# EAGLE design rainforest (EAGLE 6.5.0)
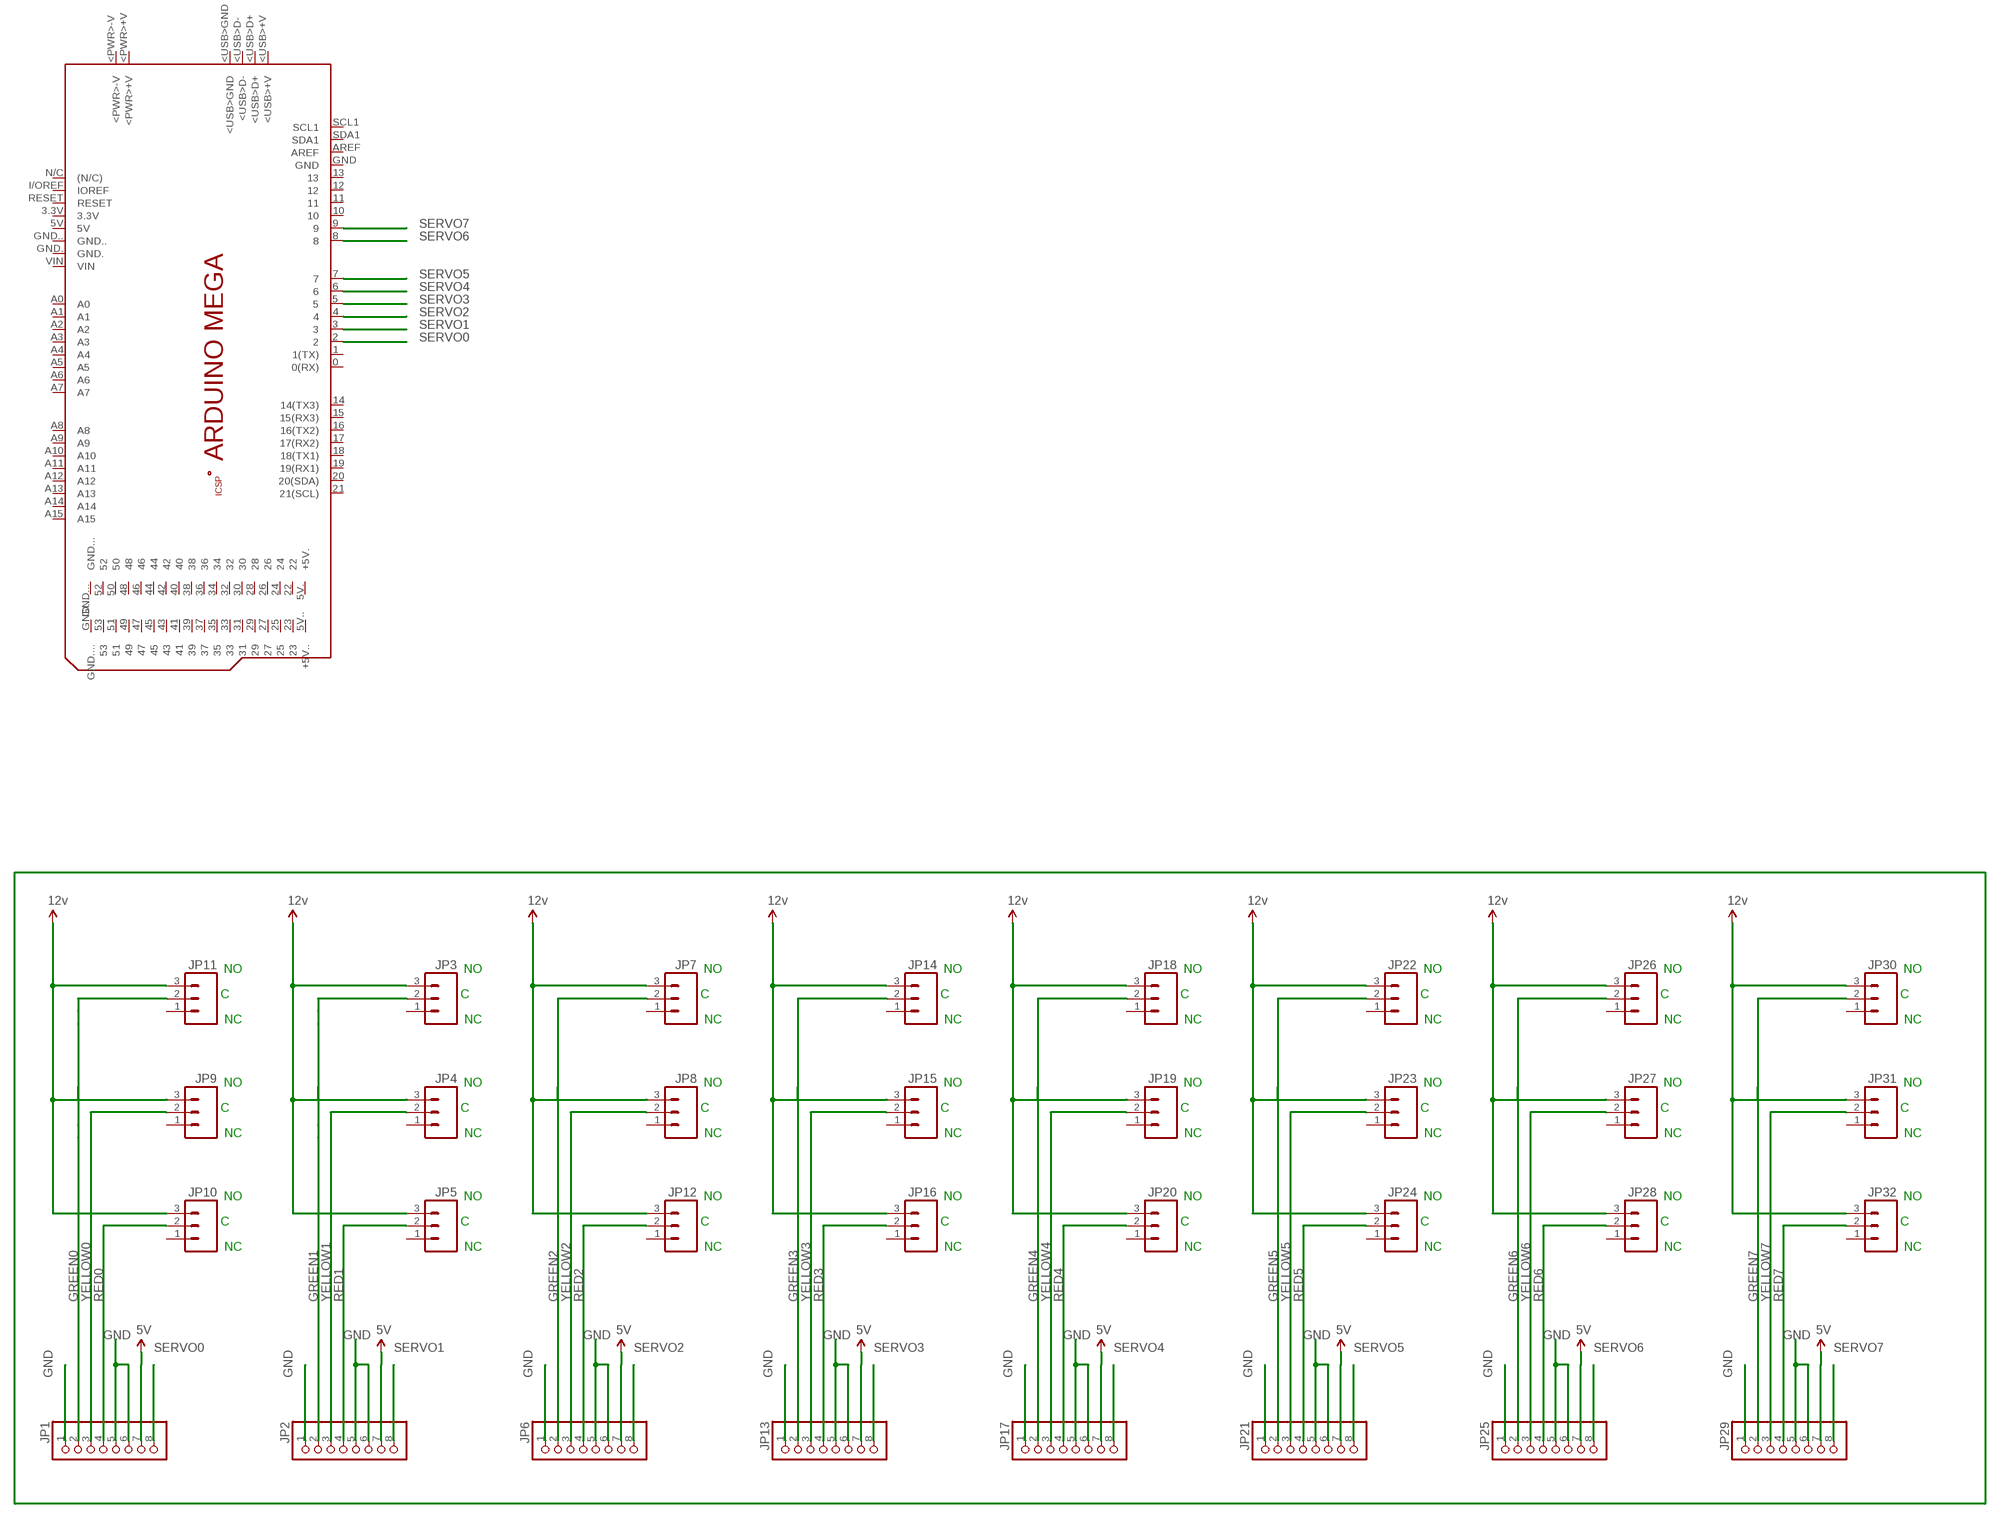
[diagram p0: schematic, sheet 1]

## Parts
JP1  PINHD-1X8  [1X08]
JP2  PINHD-1X8  [1X08]
JP3  M03PTH  [1X03]
JP4  M03PTH  [1X03]
JP5  M03PTH  [1X03]
JP6  PINHD-1X8  [1X08]
JP7  M03PTH  [1X03]
JP8  M03PTH  [1X03]
JP9  M03PTH  [1X03]
JP10  M03PTH  [1X03]
JP11  M03PTH  [1X03]
JP12  M03PTH  [1X03]
JP13  PINHD-1X8  [1X08]
JP14  M03PTH  [1X03]
JP15  M03PTH  [1X03]
JP16  M03PTH  [1X03]
JP17  PINHD-1X8  [1X08]
JP18  M03PTH  [1X03]
JP19  M03PTH  [1X03]
JP20  M03PTH  [1X03]
JP21  PINHD-1X8  [1X08]
JP22  M03PTH  [1X03]
JP23  M03PTH  [1X03]
JP24  M03PTH  [1X03]
JP25  PINHD-1X8  [1X08]
JP26  M03PTH  [1X03]
JP27  M03PTH  [1X03]
JP28  M03PTH  [1X03]
JP29  PINHD-1X8  [1X08]
JP30  M03PTH  [1X03]
JP31  M03PTH  [1X03]
JP32  M03PTH  [1X03]
PCB1  ARDUINO_MEGA  [ARDUINO_MEGA]

## Nets
5V: JP1.7 JP2.7 JP6.7 JP13.7 JP17.7 JP21.7 JP25.7 JP29.7
12V: JP3.3 JP4.3 JP5.3 JP7.3 JP8.3 JP9.3 JP10.3 JP11.3 JP12.3 JP14.3 JP15.3 JP16.3 JP18.3 JP19.3 JP20.3 JP22.3 JP23.3 JP24.3 JP26.3 JP27.3 JP28.3 JP30.3 JP31.3 JP32.3 ; supply symbol labelled 12v
GND: JP1.1 JP1.5 JP1.6 JP2.1 JP2.5 JP2.6 JP6.1 JP6.5 JP6.6 JP13.1 JP13.5 JP13.6 JP17.1 JP17.5 JP17.6 JP21.1 JP21.5 JP21.6 JP25.1 JP25.5 JP25.6 JP29.1 JP29.5 JP29.6
GREEN0: JP1.2 JP11.2
GREEN1: JP2.2 JP3.2
GREEN2: JP6.2 JP7.2
GREEN3: JP13.2 JP14.2
GREEN4: JP17.2 JP18.2
GREEN5: JP21.2 JP22.2
GREEN6: JP25.2 JP26.2
GREEN7: JP29.2 JP30.2
RED0: JP1.4 JP10.2
RED1: JP2.4 JP5.2
RED2: JP6.4 JP12.2
RED3: JP13.4 JP16.2
RED4: JP17.4 JP20.2
RED5: JP21.4 JP24.2
RED6: JP25.4 JP28.2
RED7: JP29.4 JP32.2
SERVO0: JP1.8 PCB1.2
SERVO1: JP2.8 PCB1.3
SERVO2: JP6.8 PCB1.4
SERVO3: JP13.8 PCB1.5
SERVO4: JP17.8 PCB1.6
SERVO5: JP21.8 PCB1.7
SERVO6: JP25.8 PCB1.8
SERVO7: JP29.8 PCB1.9
YELLOW0: JP1.3 JP9.2
YELLOW1: JP2.3 JP4.2
YELLOW2: JP6.3 JP8.2
YELLOW3: JP13.3 JP15.2
YELLOW4: JP17.3 JP19.2
YELLOW5: JP21.3 JP23.2
YELLOW6: JP25.3 JP27.2
YELLOW7: JP29.3 JP31.2
Unconnected: JP3.1 JP4.1 JP5.1 JP7.1 JP8.1 JP9.1 JP10.1 JP11.1 JP12.1 JP14.1 JP15.1 JP16.1 JP18.1 JP19.1 JP20.1 JP22.1 JP23.1 JP24.1 JP26.1 JP27.1 JP28.1 JP30.1 JP31.1 JP32.1 PCB1.0(0(RX)) PCB1.1(1(TX)) PCB1.3.3V PCB1.5V PCB1.5V.(+5V.) PCB1.5V..(+5V..) PCB1.10 PCB1.11 PCB1.12 PCB1.13 PCB1.14(14(TX3)) PCB1.15(15(RX3)) PCB1.16(16(TX2)) PCB1.17(17(RX2)) PCB1.18(18(TX1)) PCB1.19(19(RX1)) PCB1.20(20(SDA)) PCB1.21(21(SCL)) PCB1.22 PCB1.23 PCB1.24 PCB1.25 PCB1.26 PCB1.27 PCB1.28 PCB1.29 PCB1.30 PCB1.31 PCB1.32 PCB1.33 PCB1.34 PCB1.35 PCB1.36 PCB1.37 PCB1.38 PCB1.39 PCB1.40 PCB1.41 PCB1.42 PCB1.43 PCB1.44 PCB1.45 PCB1.46 PCB1.47 PCB1.48 PCB1.49 PCB1.50 PCB1.51 PCB1.52 PCB1.53 PCB1.+5V_ PCB1.<PWR>+V PCB1.<PWR>-V PCB1.<USB>+V PCB1.<USB>D+ PCB1.<USB>D- PCB1.<USB>GND PCB1.A0 PCB1.A1 PCB1.A2 PCB1.A3 PCB1.A4 PCB1.A5 PCB1.A6 PCB1.A7 PCB1.A8 PCB1.A9 PCB1.A10 PCB1.A11 PCB1.A12 PCB1.A13 PCB1.A14 PCB1.A15 PCB1.AREF PCB1.GND PCB1.GND. PCB1.GND.. PCB1.GND... PCB1.GND.... PCB1.GND__ PCB1.I/OREF(IOREF) PCB1.MISO PCB1.MOSI PCB1.N/C((N/C)) PCB1.RESET PCB1.RESET. PCB1.SCK PCB1.SCL1 PCB1.SDA1 PCB1.VIN

## Notes on the sheet
- NO | NO | NO | NO | NO | NO | NO | NO
- C | C | C | C | C | C | C | C
- NC | NC | NC | NC | NC | NC | NC | NC
- NO | NO | NO | NO | NO | NO | NO | NO
- C | C | C | C | C | C | C | C
- NC | NC | NC | NC | NC | NC | NC | NC
- NO | NO | NO | NO | NO | NO | NO | NO
- C | C | C | C | C | C | C | C
- NC | NC | NC | NC | NC | NC | NC | NC

## Library data of the parts
JP1 JP2 JP6 JP13 JP17 JP21 JP25 JP29 = pie:PINHD-1X8: 8-pin 0.1-inch header; PARTNUMBER: 965
JP3-JP5 JP7-JP12 JP14-JP16 JP18-JP20 JP22-JP24 JP26-JP28 JP30-JP32 = pie:M03: 3-pin 0.1-inch header and MTA connector
PCB1 = E14_Arduino:ARDUINO_MEGA: Device for representing an Arduino Mega board with a footprint in an EAGLE design. Created by Dave Young for Element14. More EAGLE documentation at: http://www.element14.com/community/community/knode/cadsoft_eagle

## Board
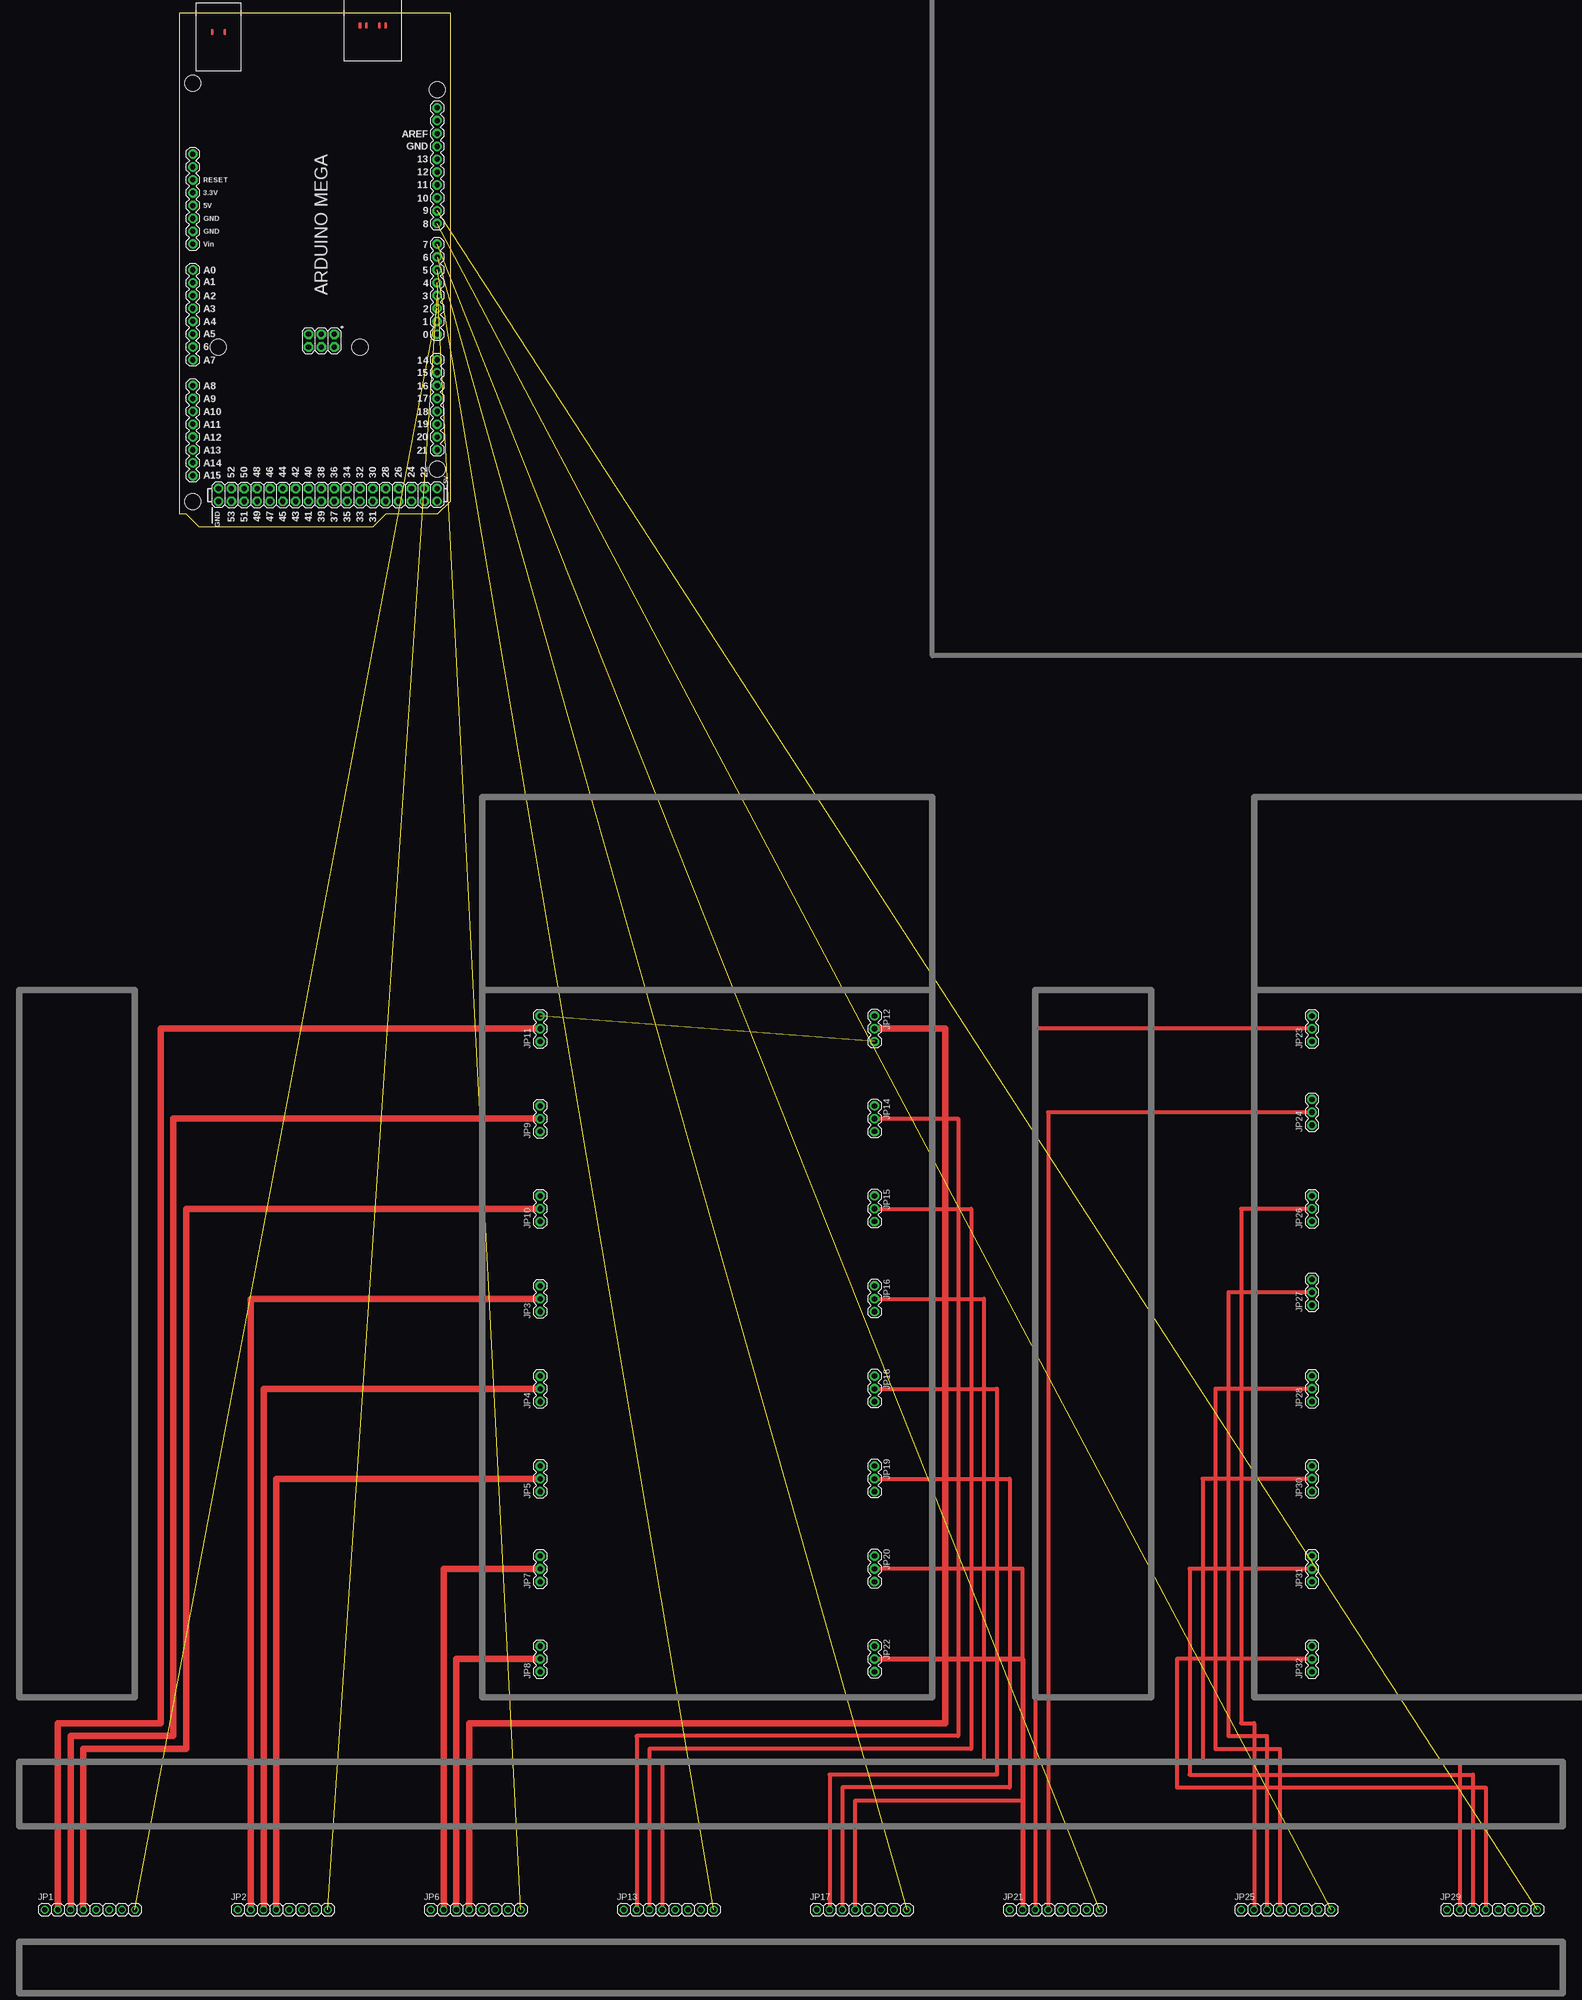
[diagram p1: board, top side]
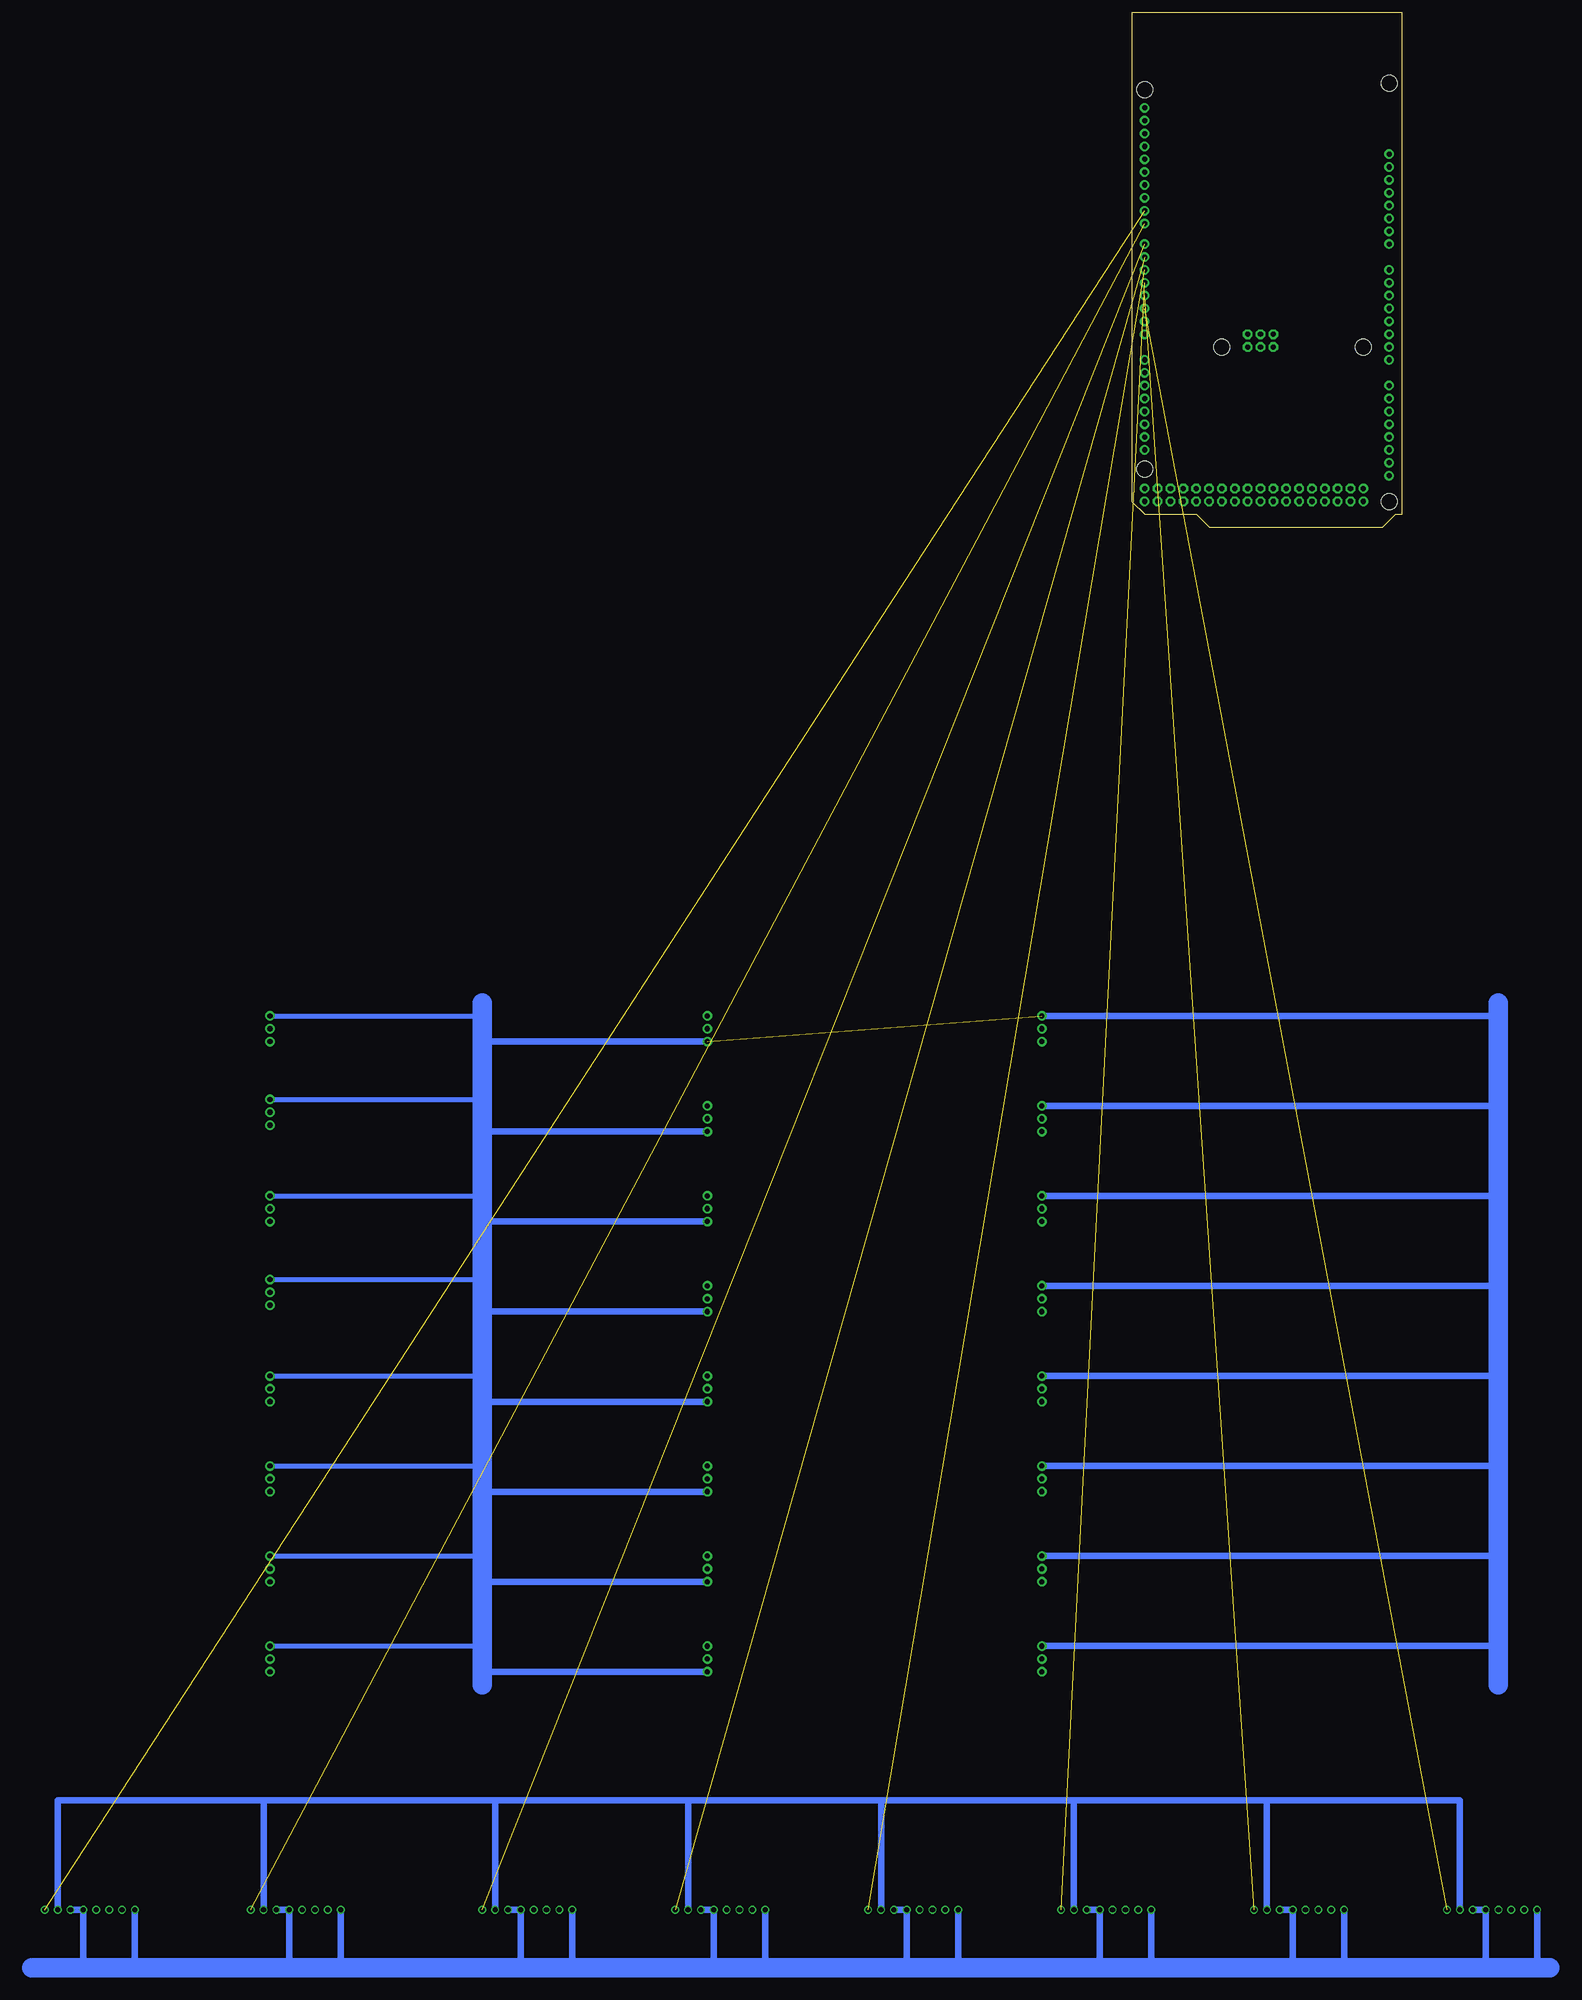
[diagram p2: board, bottom side, seen from below]

Size 53.34 x 101.6 mm. Coordinates in mm from the lower left corner, seen from the top.
Copper layers (1*16): Top 0.035mm / dielectric 1.5mm / Bottom 0.035mm
Design rules "default": minimum track width 10mil, minimum drill 0.6mm, track to track 8mil, track to pad 8mil, pad to pad 8mil, via to via 8mil, smd to smd 8mil, copper to edge 40mil, drill to drill 8mil, minimum pad ring 10mil, minimum via ring 8mil, stop-mask expansion 4mil, vias tented up to drill 0mil, thermal gap 10mil

### Footprints (pad centres in the part's own frame; a part is rotated, then mirrored left to right if it is on the bottom)
1X08 = drill 1.016 pad 1.524: 1 -8.89,0; 2 -6.35,0; 3 -3.81,0; 4 -1.27,0; 5 1.27,0; 6 3.81,0; 7 6.35,0; 8 8.89,0
1X03 = drill 1.016 pad 1.88: 1 -2.54,0; 2 0,0; 3 2.54,0
ARDUINO_MEGA = drill 1.016 pad 1.88: 0 63.5,50.8; 1 60.96,50.8; 2 58.42,50.8; 3 55.88,50.8; 3.3V 35.56,2.54; 4 53.34,50.8; 5 50.8,50.8; 5V 38.1,2.54; 5V. 93.98,50.8; 5V.. 96.52,50.8; 6 48.26,50.8; 7 45.72,50.8; 8 41.656,50.8; 9 39.116,50.8; 10 36.576,50.8; 11 34.036,50.8; 12 31.496,50.8; 13 28.956,50.8; 14 68.58,50.8; 15 71.12,50.8; 16 73.66,50.8; 17 76.2,50.8; 18 78.74,50.8; 19 81.28,50.8; 20 83.82,50.8; 21 86.36,50.8; A0 50.8,2.54; A1 53.34,2.54; A2 55.88,2.54; A3 58.42,2.54; A4 60.96,2.54; A5 63.5,2.54; A6 66.04,2.54; A7 68.58,2.54; A8 73.66,2.54; A9 76.2,2.54; A10 78.74,2.54; A11 81.28,2.54; A12 83.82,2.54; A13 86.36,2.54; A14 88.9,2.54; A15 91.44,2.54; AREF 23.876,50.8; GND 26.416,50.8; GND. 43.18,2.54; GND.. 40.64,2.54; GND... 93.98,7.62; GND.... 96.52,7.62; I/OREF 30.48,2.54; N/C 27.94,2.54; RESET 33.02,2.54; SCL1 18.796,50.8; SDA1 21.336,50.8; VIN 45.72,2.54 | drill 1.016 pad 1.88 octagon: 22 93.98,48.26; 23 96.52,48.26; 24 93.98,45.72; 25 96.52,45.72; 26 93.98,43.18; 27 96.52,43.18; 28 93.98,40.64; 29 96.52,40.64; 30 93.98,38.1; 31 96.52,38.1; 32 93.98,35.56; 33 96.52,35.56; 34 93.98,33.02; 35 96.52,33.02; 36 93.98,30.48; 37 96.52,30.48; 38 93.98,27.94; 39 96.52,27.94; 40 93.98,25.4; 41 96.52,25.4; 42 93.98,22.86; 43 96.52,22.86; 44 93.98,20.32; 45 96.52,20.32; 46 93.98,17.78; 47 96.52,17.78; 48 93.98,15.24; 49 96.52,15.24; 50 93.98,12.7; 51 96.52,12.7; 52 93.98,10.16; 53 96.52,10.16; +5V_ 66.04,30.48; GND__ 66.04,25.4; MISO 63.5,30.48; MOSI 66.04,27.94; RESET. 63.5,25.4; SCK 63.5,27.94 | smd 1.016 x 0.508: <PWR>+V 3.81,8.89; <PWR>-V 3.81,6.35; <USB>+V 2.54,40.64; <USB>D+ 2.54,39.37; <USB>D- 2.54,36.83; <USB>GND 2.54,35.56 | hole 3.2: 15.24,50.8; 13.97,2.54; 66.04,35.56; 66.04,7.62; 90.17,50.8; 96.52,2.54

### Placement (x,y rotation side)
JP1  -17.78,-273.05 0 top  (outside the outline)
JP2  20.32,-273.05 0 top  (outside the outline)
JP3  71.12,-152.4 90 top  (outside the outline)
JP4  71.12,-170.18 90 top  (outside the outline)
JP5  71.12,-187.96 90 top  (outside the outline)
JP6  58.42,-273.05 0 top  (outside the outline)
JP7  71.12,-205.74 90 top  (outside the outline)
JP8  71.12,-223.52 90 top  (outside the outline)
JP9  71.12,-116.84 90 top  (outside the outline)
JP10  71.12,-134.62 90 top  (outside the outline)
JP11  71.12,-99.06 90 top  (outside the outline)
JP12  137.16,-99.06 270 top  (outside the outline)
JP13  96.52,-273.05 0 top  (outside the outline)
JP14  137.16,-116.84 270 top  (outside the outline)
JP15  137.16,-134.62 270 top  (outside the outline)
JP16  137.16,-152.4 270 top  (outside the outline)
JP17  134.62,-273.05 0 top  (outside the outline)
JP18  137.16,-170.18 270 top  (outside the outline)
JP19  137.16,-187.96 270 top  (outside the outline)
JP20  137.16,-205.74 270 top  (outside the outline)
JP21  172.72,-273.05 0 top  (outside the outline)
JP22  137.16,-223.52 270 top  (outside the outline)
JP23  223.52,-99.06 90 top  (outside the outline)
JP24  223.52,-115.57 90 top  (outside the outline)
JP25  218.44,-273.05 0 top  (outside the outline)
JP26  223.52,-134.62 90 top  (outside the outline)
JP27  223.52,-151.13 90 top  (outside the outline)
JP28  223.52,-170.18 90 top  (outside the outline)
JP29  259.08,-273.05 0 top  (outside the outline)
JP30  223.52,-187.96 90 top  (outside the outline)
JP31  223.52,-205.74 90 top  (outside the outline)
JP32  223.52,-223.52 90 top  (outside the outline)
PCB1  0,101.6 270 top

### Tracks (layer width: path | path; a pad name or v marks a point on that pad's centre or on a via)
5V
  Bottom 1.27: JP1.7 -11.43,-251.46 26.67,-251.46 | 26.67,-251.46 JP2.7 | JP6.7 64.77,-251.46 | 64.77,-251.46 26.67,-251.46 | JP13.7 102.87,-251.46 | 102.87,-251.46 64.77,-251.46 | JP17.7 140.97,-251.46 | 140.97,-251.46 102.87,-251.46 | JP21.7 179.07,-251.46 | 179.07,-251.46 140.97,-251.46 | JP25.7 224.79,-251.46 | 224.79,-251.46 179.07,-251.46 | JP29.7 265.43,-251.46 224.79,-251.46
12V  (1 unrouted)
  Bottom 1.016: JP23.3 181.61,-96.52 | JP24.3 181.61,-113.03 181.61,-114.3 | JP26.3 181.61,-132.08 | JP27.3 181.61,-148.59 181.61,-149.86 | JP28.3 181.61,-167.64 | JP30.3 181.61,-185.42 | JP31.3 181.61,-203.2 | JP32.3 181.61,-220.98
  Bottom 1.27: JP11.3 -19.05,-96.52 | JP9.3 -19.05,-114.3 | JP10.3 -19.05,-132.08 | JP3.3 -19.05,-149.86 | JP4.3 -19.05,-167.64 | JP5.3 -19.05,-185.42 | JP7.3 -19.05,-203.2 | JP8.3 -19.05,-220.98 | JP12.3 181.61,-101.6 | JP14.3 181.61,-119.38 | JP15.3 181.61,-137.16 | JP16.3 181.61,-154.94 | JP18.3 181.61,-172.72 | JP19.3 181.61,-190.5 | JP20.3 181.61,-208.28 | JP22.3 181.61,-226.06
  Bottom 3.81: -19.05,-93.98 -19.05,-96.52 -19.05,-114.3 -19.05,-132.08 -19.05,-149.86 -19.05,-167.64 -19.05,-185.42 -19.05,-203.2 -19.05,-220.98 -19.05,-228.6 | 181.61,-93.98 181.61,-96.52 181.61,-101.6 181.61,-114.3 181.61,-119.38 181.61,-132.08 181.61,-137.16 181.61,-149.86 181.61,-154.94 181.61,-167.64 181.61,-172.72 181.61,-185.42 181.61,-190.5 181.61,-203.2 181.61,-208.28 181.61,-220.98 181.61,-226.06 181.61,-228.6
GND
  Bottom 1.27: JP1.1 -26.67,-284.48 | -16.51,-284.48 JP1.5 JP1.6 | JP2.1 11.43,-284.48 | JP2.6 JP2.5 21.59,-284.48 | JP6.1 49.53,-284.48 | 59.69,-284.48 JP6.5 JP6.6 | JP13.1 87.63,-284.48 | 97.79,-284.48 JP13.5 JP13.6 | JP17.1 125.73,-284.48 | 135.89,-284.48 JP17.5 JP17.6 | JP21.1 163.83,-284.48 | 173.99,-284.48 JP21.5 JP21.6 | JP25.1 209.55,-284.48 | 219.71,-284.48 JP25.5 JP25.6 | JP29.1 250.19,-284.48 | 260.35,-284.48 260.35,-274.32 JP29.5 JP29.6
  Bottom 3.81: -29.21,-284.48 -26.67,-284.48 -16.51,-284.48 11.43,-284.48 21.59,-284.48 49.53,-284.48 59.69,-284.48 87.63,-284.48 97.79,-284.48 125.73,-284.48 135.89,-284.48 163.83,-284.48 173.99,-284.48 209.55,-284.48 219.71,-284.48 250.19,-284.48 260.35,-284.48 270.51,-284.48
GREEN0
  Top 1.27: JP11.2 -3.81,-99.06 -3.81,-236.22 -24.13,-236.22 JP1.2
GREEN1
  Top 1.27: JP3.2 13.97,-152.4 JP2.2
GREEN2
  Top 1.27: JP7.2 52.07,-205.74 JP6.2
GREEN3
  Top 0.813: JP14.2 153.67,-116.84 153.67,-238.76 90.17,-238.76 JP13.2
GREEN4
  Top 0.813: JP18.2 161.29,-170.18 161.29,-246.38 128.27,-246.38 JP17.2
GREEN5
  Top 1.016: JP22.2 166.37,-223.52 JP21.2
GREEN6
  Top 0.813: JP26.2 209.55,-134.62 209.55,-236.22 212.09,-236.22 JP25.2
GREEN7
  Top 0.813: JP30.2 201.93,-187.96 201.93,-243.84 252.73,-243.84 JP29.2
RED0
  Top 1.27: JP10.2 1.27,-134.62 1.27,-241.3 -19.05,-241.3 JP1.4
RED1
  Top 1.27: JP5.2 19.05,-187.96 JP2.4
RED2
  Top 1.27: JP12.2 151.13,-99.06 151.13,-236.22 57.15,-236.22 JP6.4
RED3
  Top 0.813: JP16.2 158.75,-152.4 158.75,-243.84 95.25,-243.84 JP13.4
RED4
  Top 0.813: JP17.4 133.35,-251.46 166.37,-251.46 166.37,-205.74 JP20.2
RED5
  Top 0.813: JP24.2 171.45,-115.57 JP21.4
RED6
  Top 0.813: JP28.2 204.47,-170.18 204.47,-241.3 217.17,-241.3 JP25.4
RED7
  Top 0.813: JP32.2 196.85,-223.52 196.85,-248.92 257.81,-248.92 JP29.4
SERVO0  (1 unrouted)
SERVO1  (1 unrouted)
SERVO2  (1 unrouted)
SERVO3  (1 unrouted)
SERVO4  (1 unrouted)
SERVO5  (1 unrouted)
SERVO6  (1 unrouted)
SERVO7  (1 unrouted)
YELLOW0
  Top 1.27: JP9.2 -1.27,-116.84 -1.27,-238.76 -21.59,-238.76 JP1.3
YELLOW1
  Top 1.27: JP4.2 16.51,-170.18 JP2.3
YELLOW2
  Top 1.27: JP8.2 54.61,-223.52 JP6.3
YELLOW3
  Top 0.813: JP15.2 156.21,-134.62 156.21,-241.3 92.71,-241.3 JP13.3
YELLOW4
  Top 0.813: JP19.2 163.83,-187.96 163.83,-248.92 130.81,-248.92 JP17.3
YELLOW5
  Top 0.813: JP23.2 168.91,-99.06 JP21.3
YELLOW6
  Top 0.813: JP27.2 207.01,-151.13 207.01,-238.76 214.63,-238.76 JP25.3
YELLOW7
  Top 0.813: JP31.2 199.39,-205.74 199.39,-246.38 255.27,-246.38 JP29.3

### Text on the board
tDocu: PSU | 12V Bus | 12V Bus | 5V Bus | GND Bus